# Altium schematic sheet ECU_Sheet5.SchDoc
size A3
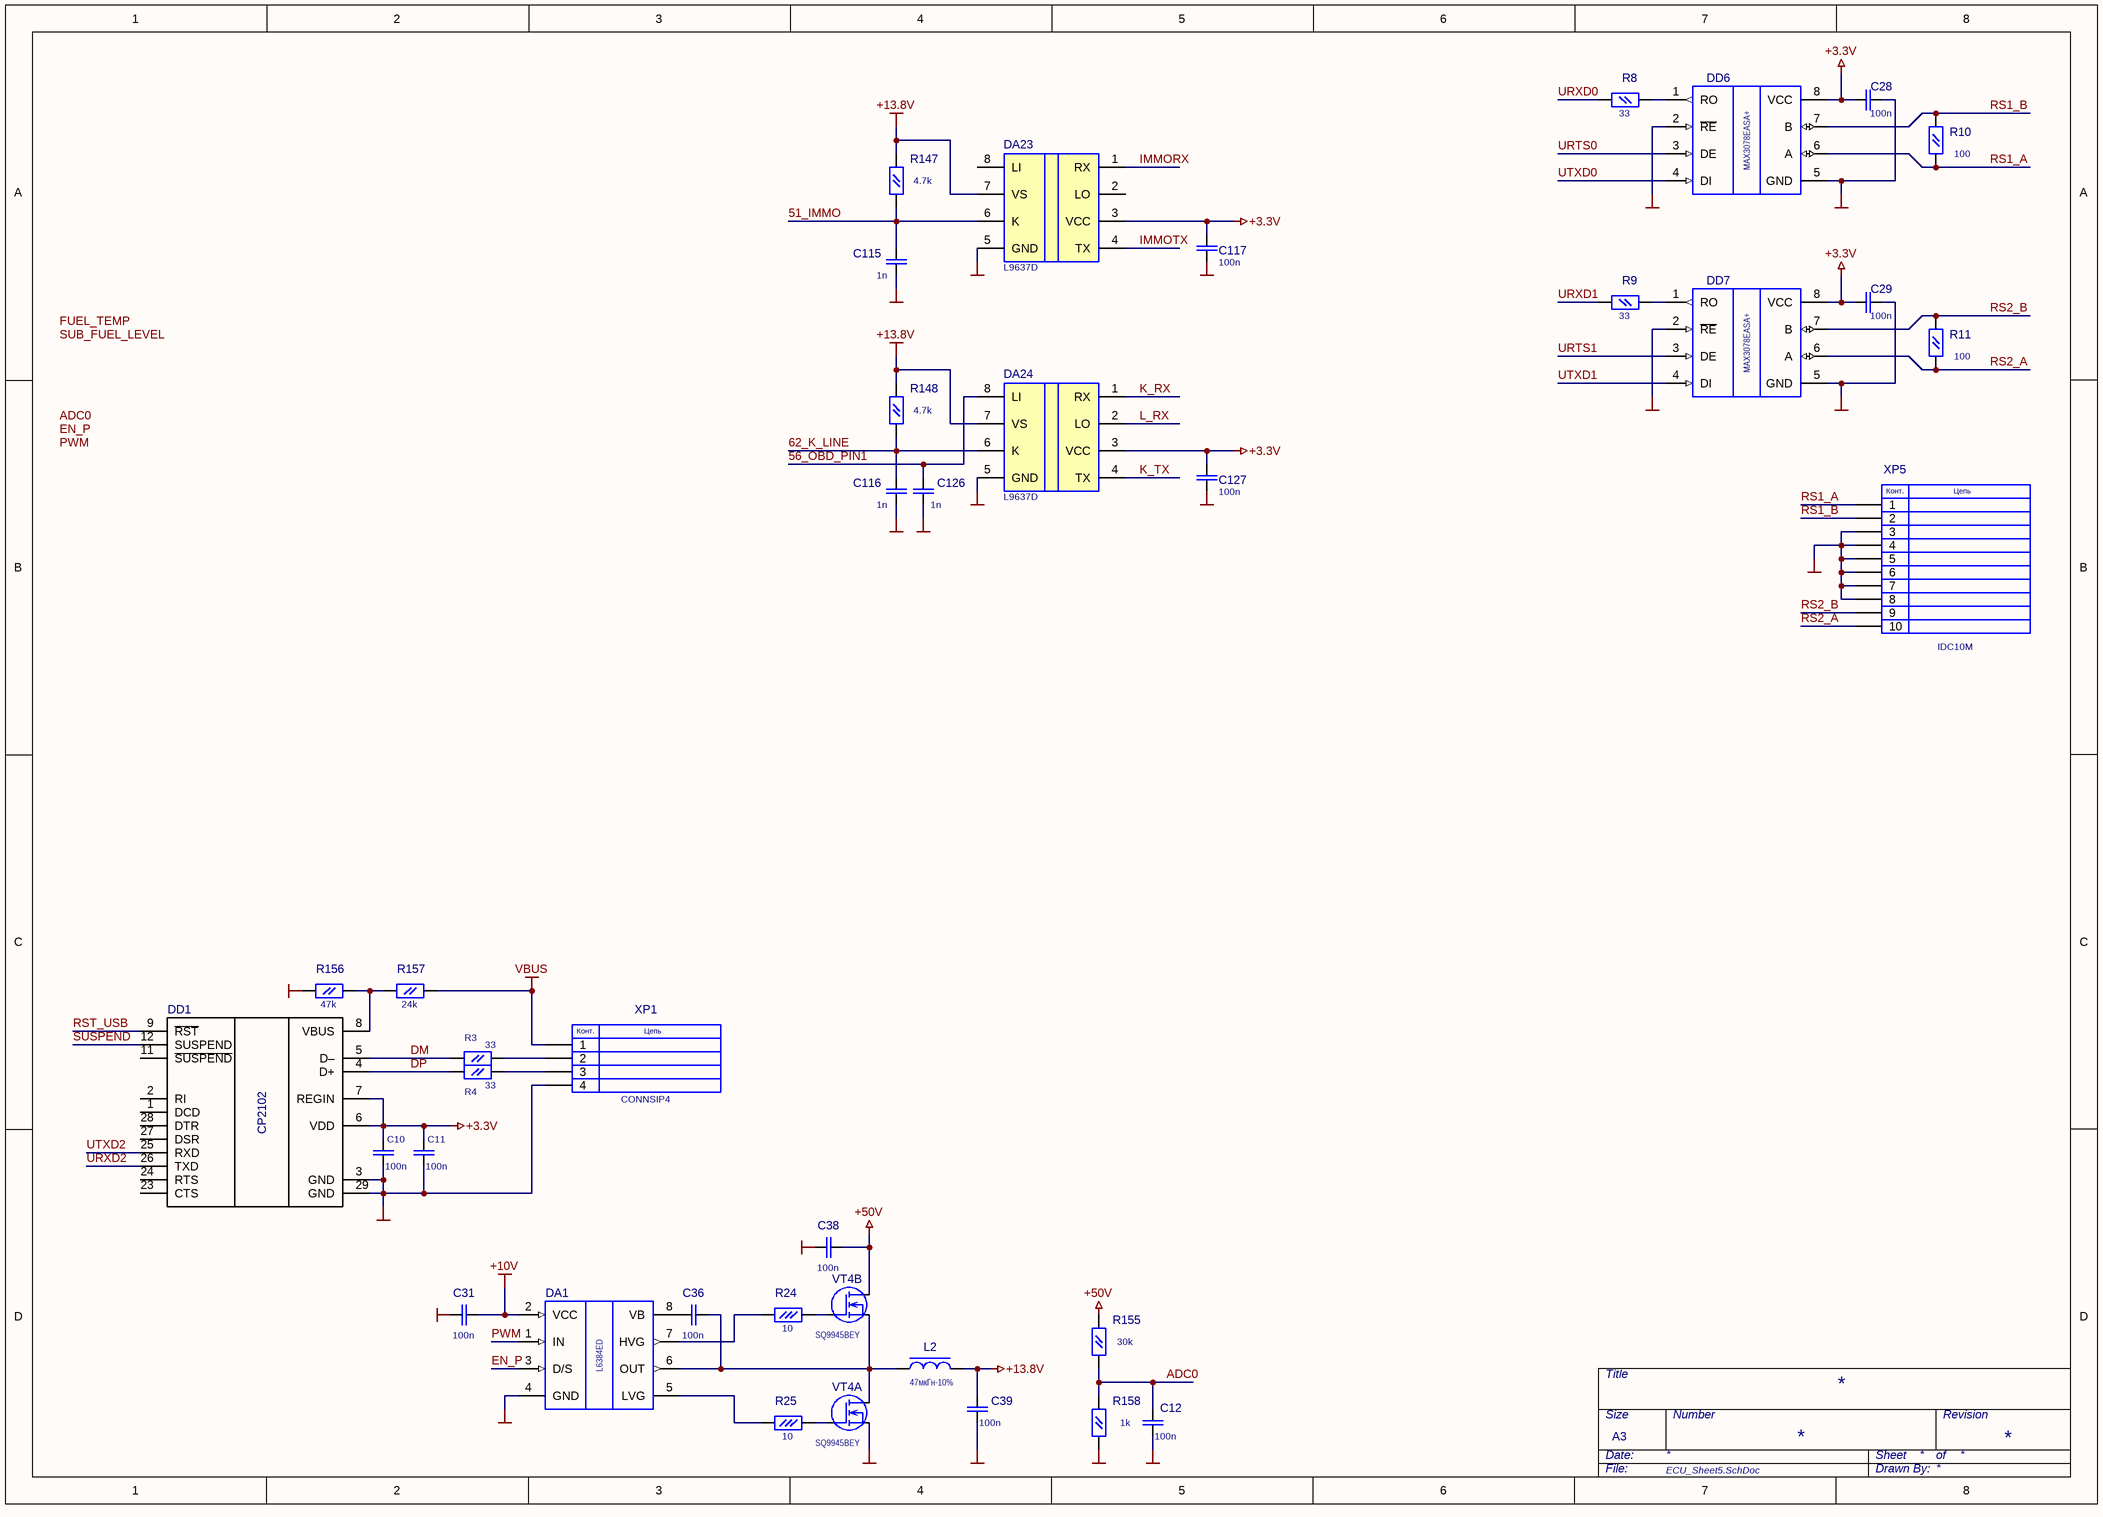
[diagram p0: ECU_Sheet5.SchDoc]

## Parts
C10  value 100n  [C0603L]  (hidden comment: CSMD)
C11  value 100n  [C0603L]  (hidden comment: CSMD)
C12  value 100n  [C0805L]  (hidden comment: 0.1мкФ-25В-X8R-10%)
C28  value 100n  [C0805L]  (hidden comment: 0.1мкФ-50В-X8R-10%)
C29  value 100n  [C0805L]  (hidden comment: 0.1мкФ-50В-X8R-10%)
C31  value 100n  [C0805L]  (hidden comment: CSMD)
C36  value 100n  [C0805L]  (hidden comment: CSMD)
C38  value 100n  [C0805L]  (hidden comment: CSMD)
C39  value 100n  [C0805L]  (hidden comment: 0.1мкФ-25В-X8R-10%)
C115  value 1n  [C0805L]  (hidden comment: CSMD)
C116  value 1n  [C0805L]  (hidden comment: CSMD)
C117  value 100n  [C0805L]  (hidden comment: 1мкФ-25В-X7R-10%)
C126  value 1n  [C0805L]  (hidden comment: CSMD)
C127  value 100n  [C0805L]  (hidden comment: 1мкФ-25В-X7R-10%)
DA1  L6384ED  [SOIC8 JEDEC]
DA23  L9637D  [SOIC8 JEDEC]
DA24  L9637D  [SOIC8 JEDEC]
DD1  CP2102  [QFN-28]
DD6  MAX3078EASA+  [SOIC8 JEDEC]
DD7  MAX3078EASA+  [SOIC8 JEDEC]
L2  47мкГн-10%  [L_SDR0604]
R3  value 33  [R0603L]  (hidden comment: RSMD)
R4  value 33  [R0603L]  (hidden comment: RSMD)
R8  value 33  [R0603L]  (hidden comment: 33-5%)
R9  value 33  [R0603L]  (hidden comment: 33-5%)
R10  value 100  [R0805L]  (hidden comment: 100-5%)
R11  value 100  [R0805L]  (hidden comment: 100-5%)
R24  value 10  [R0603L]  (hidden comment: 100-5%)
R25  value 10  [R0603L]  (hidden comment: 100-5%)
R147  value 4.7k  [R0805L]  (hidden comment: RSMD)
R148  value 4.7k  [R0805L]  (hidden comment: RSMD)
R155  value 30k  [R0805L]  (hidden comment: RSMD)
R156  value 47k  [R0805L]  (hidden comment: RSMD)
R157  value 24k  [R0805L]  (hidden comment: RSMD)
R158  value 1k  [R0805L]  (hidden comment: RSMD)
VT4  SQ9945BEY  [SOIC8 DBL FET]  (parts A,B of 2)
XP1  CONNSIP4  [SIP4]
XP5  IDC10M  [IDC10M]

## Nets
+3.3V: C10.2 C11.2 C28.1 C29.1 C117.2 C127.2 DA23.3(VCC) DA24.3(VCC) DD1.6(VDD) DD1.7(REGIN) DD6.8(VCC) DD7.8(VCC)
+10V: C31.1 DA1.2(VCC)
+13.8V: C39.1 DA23.7(VS) DA24.7(VS) L2.1 R147.2(Pin2) R148.2(Pin2)
+50V: C38.1 R155.2(Pin2) VT4.5
GND: C10.1 C11.1 C12.1 C28.2 C29.2 C31.2 C38.2 C39.2 C115.2 C116.2 C117.1 C126.2 C127.1 DA1.4(GND) DA23.5(GND) DA24.5(GND) DD1.3(GND) DD1.29(GND) DD6.2(~{RE}) DD6.5(GND) DD7.2(~{RE}) DD7.5(GND) R156.1(Pin1) R158.1(Pin1) VT4.1 XP1.4 XP5.3 XP5.4 XP5.5 XP5.6 XP5.7 XP5.8
VBUS: R157.2(Pin2) XP1.1
51_IMMO: C115.1 DA23.6(K) R147.1(Pin1)
56_OBD_PIN1: C126.1 DA24.8(LI)
62_K_LINE: C116.1 DA24.6(K) R148.1(Pin1)
ADC0: C12.2 R155.1(Pin1) R158.2(Pin2)
DM: DD1.5(D–) R3.1(Pin1)
DP: DD1.4(D+) R4.1(Pin1)
EN_P: DA1.3(D/S)
IMMORX: DA23.1(RX)
IMMOTX: DA23.4(TX)
K_RX: DA24.1(RX)
K_TX: DA24.4(TX)
L_RX: DA24.2(LO)
PWM: DA1.1(IN)
RS1_A: DD6.6(A) R10.1(Pin1) XP5.1
RS1_B: DD6.7(B) R10.2(Pin2) XP5.2
RS2_A: DD7.6(A) R11.1(Pin1) XP5.10
RS2_B: DD7.7(B) R11.2(Pin2) XP5.9
RST_USB: DD1.9(~{RST})
SUSPEND: DD1.12(SUSPEND)
URTS0: DD6.3(DE)
URTS1: DD7.3(DE)
URXD0: R8.2(Pin2)
URXD1: R9.2(Pin2)
URXD2: DD1.26(TXD)
UTXD0: DD6.4(DI)
UTXD1: DD7.4(DI)
UTXD2: DD1.25(RXD)
NetC36_1: C36.1 DA1.6(OUT) L2.2 VT4.3 VT4.6
NetC36_2: C36.2 DA1.8(VB)
NetDA1_5: DA1.5(LVG) R25.2
NetDA1_7: DA1.7(HVG) R24.2
NetDD1_8: DD1.8(VBUS) R156.2(Pin2) R157.1(Pin1)
NetDD6_1: DD6.1(RO) R8.1(Pin1)
NetDD7_1: DD7.1(RO) R9.1(Pin1)
NetR3_2: R3.2(Pin2) XP1.2
NetR4_2: R4.2(Pin2) XP1.3
NetR24_1: R24.1 VT4.4
NetR25_1: R25.1 VT4.2

Not connected (* = marked no-connect by the designer): DA23 2(LO) 8(LI); DD1 1(DCD) 2(RI) 10(NC) 11(~{SUSPEND}) 13(NC) 14(NC) 15(NC) 16(NC) 17(NC) 18(NC) 19(NC) 20(NC) 21(NC) 22(NC) 23(CTS) 24(RTS) 27(DSR) 28(DTR)

## Notes on the sheet
- Labels drawn without touching a wire or pin: ADC0, EN_P, FUEL_TEMP, PWM, SUB_FUEL_LEVEL
- Title
- Date:
- Size
- A3
- Number
- Sheet
- of
- Revision
- File:
- Drawn By:
- (in symbol CONNSIP4) Конт.; Цепь
- (in symbol IDC10M) Конт.; Цепь

## Library data of the parts
C10 C11 C28 C29 C31 C36 C38 C39 C115 C116 C126 = CSMD: C0603; Voltage: *; Part Field 1: *; Part Field 2: *
C12 = CSMD: C0603; Part Field 1: CGA3E2X8R1E104K080AA; Voltage: *; Part Field 2: *
C117 C127 = CSMD: C0603; Part Field 1: 0805; Voltage: *
DA23 DA24 = L9637: Monolithic bus driver with ISO 9141 interface; Part Field 1: *; Part Field 2: *
DD6 DD7 = MAX3088ESA: MAX3078EASA+ или ISL3179EFBZ или ADM3078EYRZ; Value: *
L2 = DROSSEL3: Part Field 1: SDR0604- 470KL
R3 R4 R8-R11 R24 R25 R147 R148 R155-R158 = RSMD: R0805
  R3 R4 R8-R11 R24 R25 R156 R157: Part Field 1: *; Part Field 2: *
XP1 = CONNSIP4: Value: *
XP5 = IDC10M: Value: *